# EAGLE board firefly-ice-blue (EAGLE 6.4)
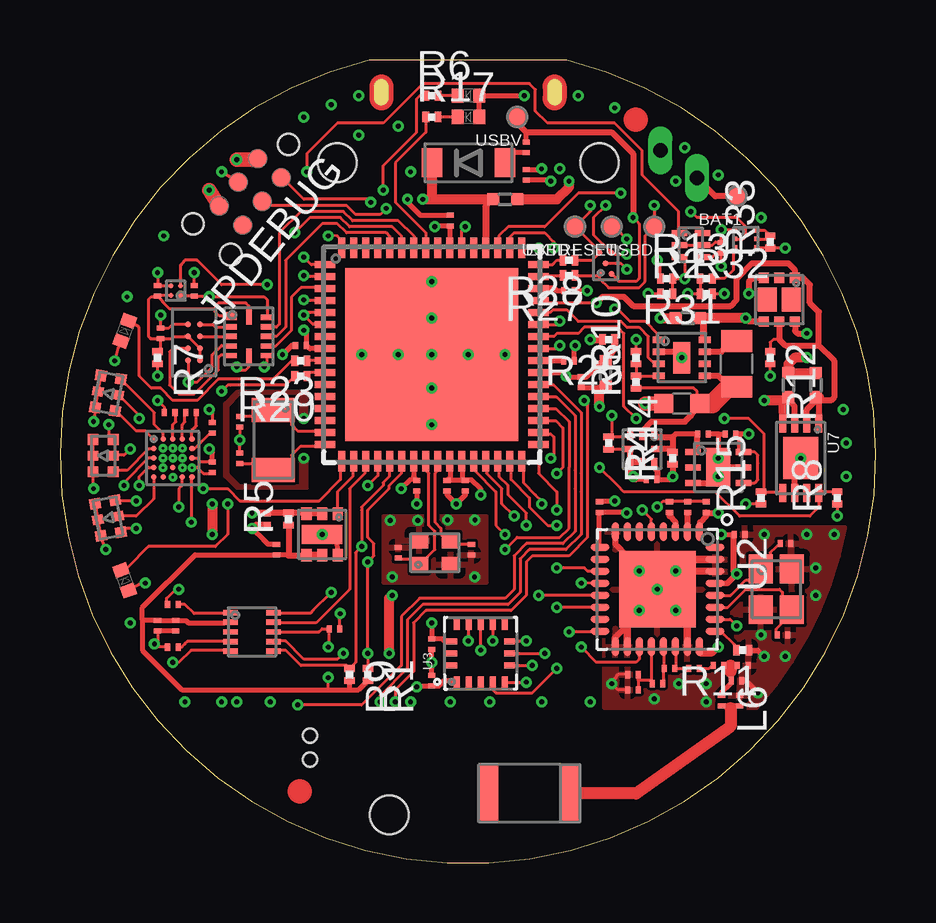
[diagram p7: board, top side]
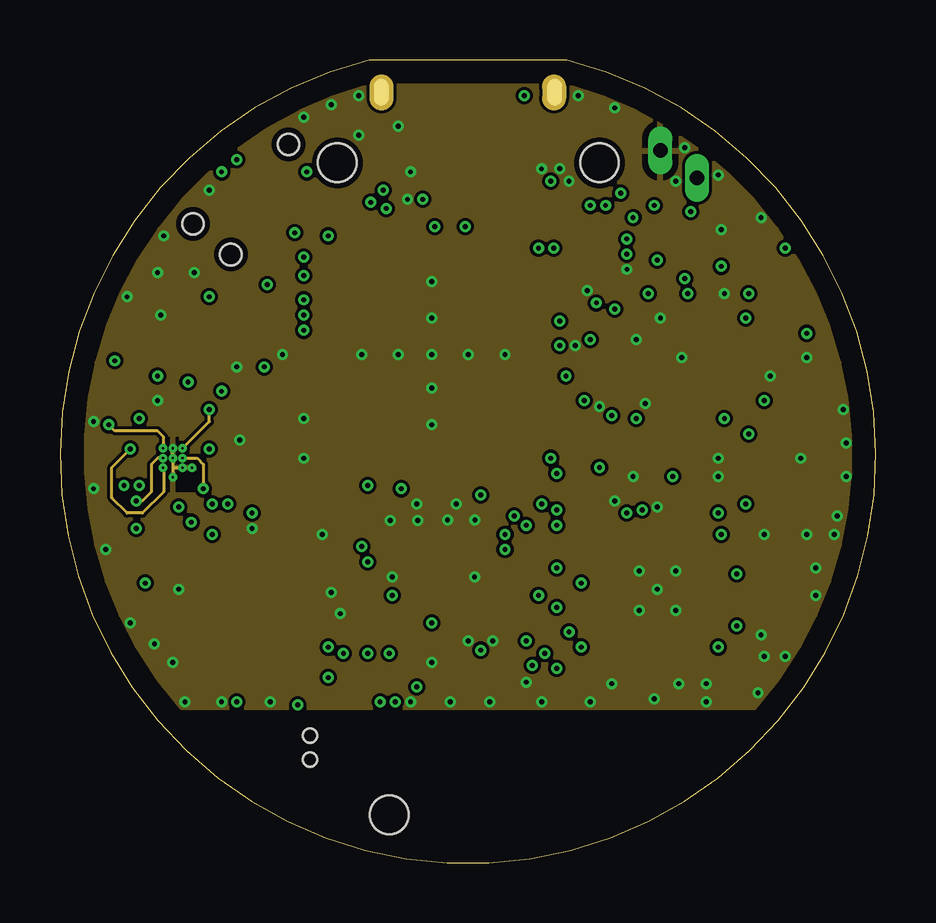
[diagram p8: board, inner layer Route2]
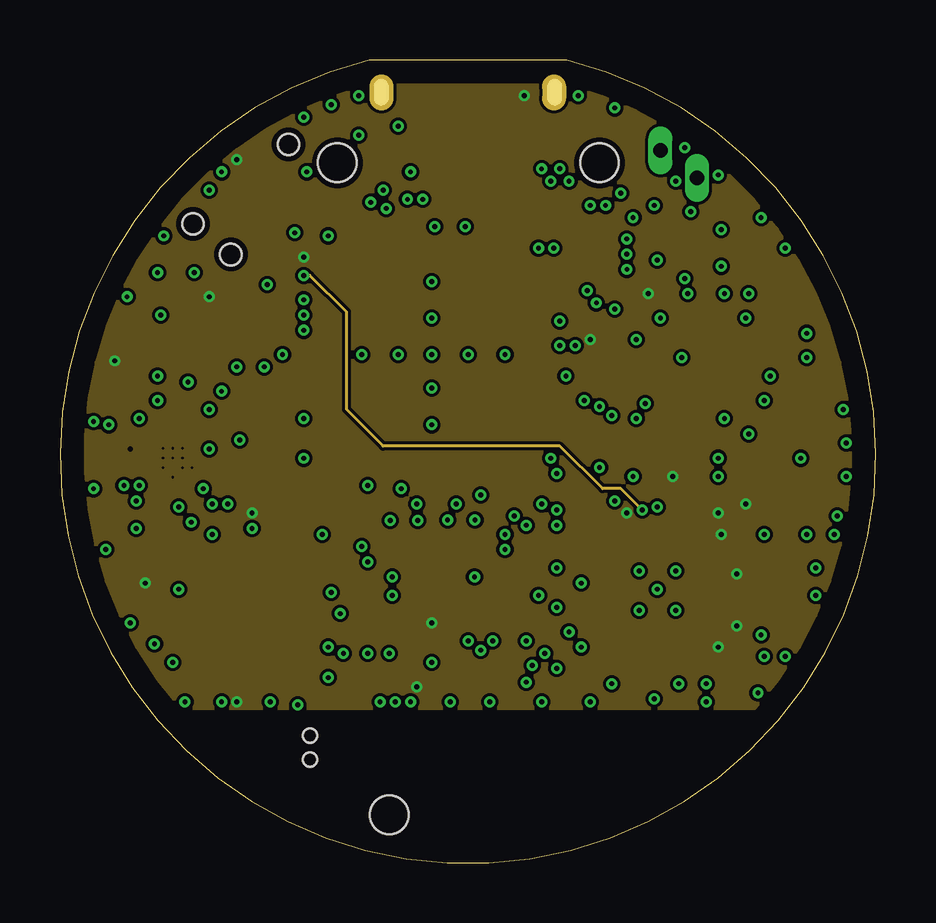
[diagram p9: board, inner layer Route15]
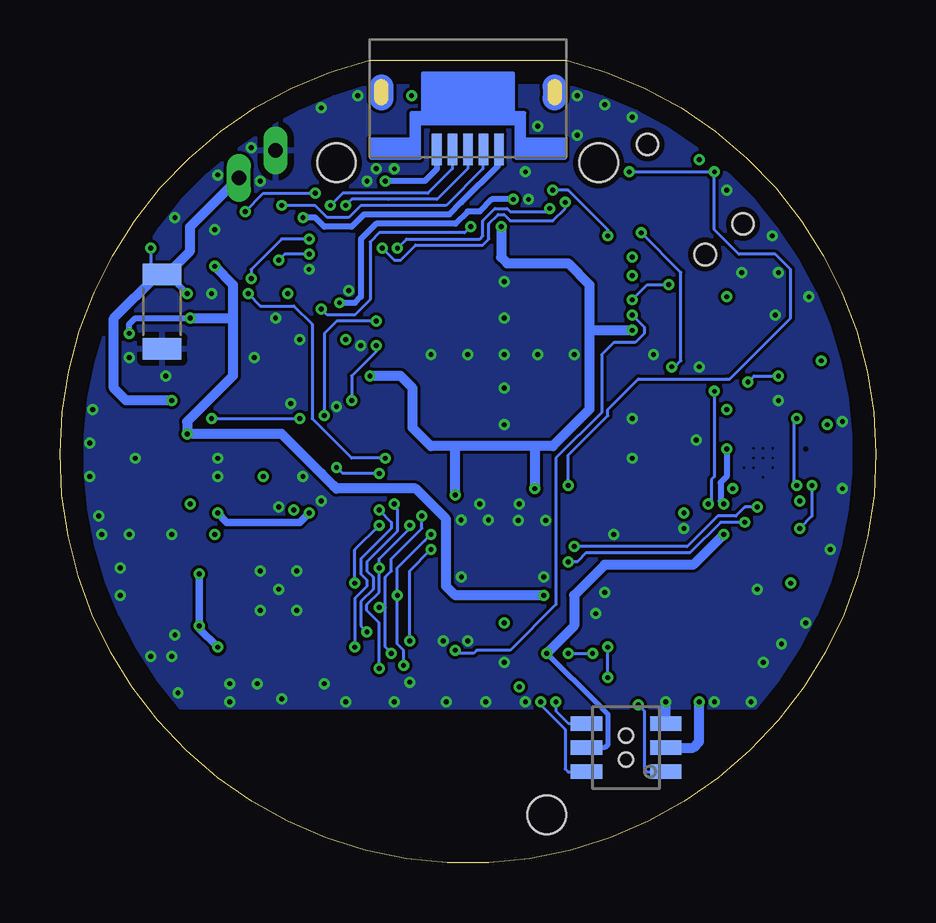
[diagram p10: board, bottom side, seen from below]

Size 34 x 33.47 mm. Coordinates in mm from the lower left corner, seen from the top.
Outline: 12.89,33.47 arc332 21.11,33.47 12.89,33.47
Copper layers [2:(1+2*15+16)]: Top 0.0178mm / dielectric 6mil / Route2 0.0356mm / dielectric 14mil / Route15 0.0356mm / dielectric 6mil / Bottom 0.0178mm
Design rules "SSC-EAGLE-4Lyr_v1.0.0.3 *": minimum track width 5mil, minimum drill 0.2mm, track to track 5mil, track to pad 5mil, pad to pad 5mil, via to via 5mil, smd to smd 5mil, copper to edge 10mil, drill to drill 16mil, minimum pad ring 8mil, minimum via ring 5mil, stop-mask expansion 3mil, vias tented up to drill 8mil, thermal gap 10mil
Holes 1.6 mm at 22.48,29.19 11.56,29.19 13.72,2.01

## Footprints (pad centres in the part's own frame; a part is rotated, then mirrored left to right if it is on the bottom)
FR05_S1_N_0_110 = smd 0.8 x 2.4: FP -1.7,0; MP 1.7,0
WP-28AWG = drill 0.6 long: 1 0,0
TARGET-PIN-1MM = smd 0.84 x 0.84: 1 0,0
C0201 = smd 0.21 x 0.3: 1 -0.22,0; 2 0.22,0
C0402 = smd 0.5 x 0.5: 1 -0.5,0; 2 0.5,0
C0603 = smd 0.8 x 0.8: 1 -0.75,0; 2 0.75,0
C1206 = smd 0.9 x 1.6: 1 -1.55,0; 2 1.55,0
D0402 = smd 0.5 x 0.6: A 0.45,0; C -0.45,0
SMLP36 = smd 0.45 x 0.45: 1 -0.675,-0.425; 2 -0.675,0.425; 5 0.675,-0.425; 6 0.675,0.425 | smd 0.4 x 0.45: 3 0,-0.425; 4 0,0.425
SOD-123F = smd 0.85 x 1.2: A 1.525,0; C -1.525,0
ZX62WD1-B-5PC = smd 0.4 x 1.3: 1 -1.3,3.73; 2 -0.65,3.73; 3 0,3.73; 4 0.65,3.73; 5 1.3,3.73
M40-3100345R = smd 1.3 x 0.6: 1 -1.65,1; 2 -1.65,0; 3 -1.65,-1; 4 1.65,-1; 5 1.65,0; 6 1.65,1 | hole 0.6: 0,-0.5; 0,0.5
TC2030-MCP-NL = smd 0.787 x 0.787: 1 1.27,-0.635; 2 1.27,0.635; 3 2.54,-0.635; 4 2.54,0.635 | smd 0.72 x 0.72: 5 3.81,-0.635; 6 3.81,0.635 | hole 0.889: 0,0; 5.08,-1.016; 5.08,1.016
L0201 = smd 0.21 x 0.3: 1 -0.22,0; 2 0.22,0
L0805 = smd 0.9 x 1.3: 1 -0.95,0; 2 0.95,0
R0201 = smd 0.28 x 0.43: 1 -0.255,0; 2 0.255,0
QFN64 = smd 0.85 x 0.3: 1 -4.45,3.75; 2 -4.45,3.25; 3 -4.45,2.75; 4 -4.45,2.25; 5 -4.45,1.75; 6 -4.45,1.25; 7 -4.45,0.75; 8 -4.45,0.25; 9 -4.45,-0.25; 10 -4.45,-0.75; 11 -4.45,-1.25; 12 -4.45,-1.75; 13 -4.45,-2.25; 14 -4.45,-2.75; 15 -4.45,-3.25; 16 -4.45,-3.75; 33 4.45,-3.75; 34 4.45,-3.25; 35 4.45,-2.75; 36 4.45,-2.25; 37 4.45,-1.75; 38 4.45,-1.25; 39 4.45,-0.75; 40 4.45,-0.25; 41 4.45,0.25; 42 4.45,0.75; 43 4.45,1.25; 44 4.45,1.75; 45 4.45,2.25; 46 4.45,2.75; 47 4.45,3.25; 48 4.45,3.75 | smd 0.3 x 0.85: 17 -3.75,-4.45; 18 -3.25,-4.45; 19 -2.75,-4.45; 20 -2.25,-4.45; 21 -1.75,-4.45; 22 -1.25,-4.45; 23 -0.75,-4.45; 24 -0.25,-4.45; 25 0.25,-4.45; 26 0.75,-4.45; 27 1.25,-4.45; 28 1.75,-4.45; 29 2.25,-4.45; 30 2.75,-4.45; 31 3.25,-4.45; 32 3.75,-4.45; 49 3.75,4.45; 50 3.25,4.45; 51 2.75,4.45; 52 2.25,4.45; 53 1.75,4.45; 54 1.25,4.45; 55 0.75,4.45; 56 0.25,4.45; 57 -0.25,4.45; 58 -0.75,4.45; 59 -1.25,4.45; 60 -1.75,4.45; 61 -2.25,4.45; 62 -2.75,4.45; 63 -3.25,4.45; 64 -3.75,4.45 | smd 7.2 x 7.2: 65 0,0
QFN-32 = smd 0.8 x 0.3: 1 -2.4,1.75; 2 -2.4,1.25; 3 -2.4,0.75; 4 -2.4,0.25; 5 -2.4,-0.25; 6 -2.4,-0.75; 7 -2.4,-1.25; 8 -2.4,-1.75; 17 2.4,-1.75; 18 2.4,-1.25; 19 2.4,-0.75; 20 2.4,-0.25; 21 2.4,0.25; 22 2.4,0.75; 23 2.4,1.25; 24 2.4,1.75 | smd 0.3 x 0.8: 9 -1.75,-2.4; 10 -1.25,-2.4; 11 -0.75,-2.4; 12 -0.25,-2.4; 13 0.25,-2.4; 14 0.75,-2.4; 15 1.25,-2.4; 16 1.75,-2.4; 25 1.75,2.4; 26 1.25,2.4; 27 0.75,2.4; 28 0.25,2.4; 29 -0.25,2.4; 30 -0.75,2.4; 31 -1.25,2.4; 32 -1.75,2.4 | smd 3.2 x 3.2: 33 0,0
LGA16_3X3 = smd 0.45 x 0.25: 1 -1.2,1; 2 -1.2,0.5; 3 -1.2,0; 4 -1.2,-0.5; 5 -1.2,-1; 9 1.2,-1; 10 1.2,-0.5; 11 1.2,0; 12 1.2,0.5; 13 1.2,1 | smd 0.25 x 0.45: 6 -0.5,-1.2; 7 0,-1.2; 8 0.5,-1.2; 14 0.5,1.2; 15 0,1.2; 16 -0.5,1.2
DFN10-2X2 = smd 0.6 x 0.225: 1 -0.9,0.8; 2 -0.9,0.4; 3 -0.9,0; 4 -0.9,-0.4; 5 -0.9,-0.8; 6 0.9,-0.8; 7 0.9,-0.4; 8 0.9,0; 9 0.9,0.4; 10 0.9,0.8
WL-CSP-25 = smd 0.225 x 0.225: A1 -0.8,0.8; A2 -0.4,0.8; A3 0,0.8; A4 0.4,0.8; A5 0.8,0.8; B1 -0.8,0.4; B2 -0.4,0.4; B3 0,0.4; B4 0.4,0.4; B5 0.8,0.4; C1 -0.8,0; C2 -0.4,0; C3 0,0; C4 0.4,0; C5 0.8,0; D1 -0.8,-0.4; D2 -0.4,-0.4; D3 0,-0.4; D4 0.4,-0.4; D5 0.8,-0.4; E1 -0.8,-0.8; E2 -0.4,-0.8; E3 0,-0.8; E4 0.4,-0.8; E5 0.8,-0.8
SOT963 = smd 0.2 x 0.2: 1 -0.45,0.36; 2 -0.45,0; 3 -0.45,-0.36; 4 0.45,-0.36; 5 0.45,0; 6 0.45,0.36
DFN8 = smd 0.75 x 0.3: 1 -1.45,0.75; 2 -1.45,0.25; 3 -1.45,-0.25; 4 -1.45,-0.75; 5 1.45,-0.75; 6 1.45,-0.25; 7 1.45,0.25; 8 1.45,0.75 | smd 1.75 x 1.45: PGND 0,0
WLCSP5 = smd 0.26 x 0.26: A1 -0.435,0.25; A2 -0.435,-0.25; B1 0,0; C1 0.435,0.25; C2 0.435,-0.25
MICROFET-2X2-6L = smd 0.52 x 0.42: 1 -0.865,0.65; 2 -0.865,0; 3 -0.865,-0.65; 4 0.865,-0.65; 5 0.865,0; 6 0.865,0.65 | smd 0.8 x 1.68: 7 0,0
UDFN6 = smd 0.65 x 0.25: 1 -0.475,0.5; 2 -0.475,0; 3 -0.475,-0.5; 4 0.475,-0.5; 5 0.475,0; 6 0.475,0.5
S-PWSON-N6 = smd 0.65 x 0.25: 1 -1.05,0.65; 2 -1.05,0; 3 -1.05,-0.65; 4 1.05,-0.65; 5 1.05,0; 6 1.05,0.65 | smd 1 x 1.6: TP 0,0
S-PWSON-N8 = smd 0.5 x 0.28: 1 -0.95,0.75; 2 -0.95,0.25; 3 -0.95,-0.25; 4 -0.95,-0.75; 5 0.95,-0.75; 6 0.95,-0.25; 7 0.95,0.25; 8 0.95,0.75 | smd 0.7 x 1.3: TP 0,0
SOT902-2 = smd 0.35 x 0.25: 1 -0.55,0.5; 2 -0.55,0; 3 -0.55,-0.5; 5 0.55,-0.5; 6 0.55,0; 7 0.55,0.5 | smd 0.25 x 0.35: 4 0,-0.55; 8 0,0.55
MO-229 = smd 0.42 x 0.42: 1 -0.915,0.65; 2 -0.915,0; 3 -0.915,-0.65; 4 0.915,-0.65; 5 0.915,0; 6 0.915,0.65 | smd 1 x 0.8: C 0,0.5; D 0,-0.5
WLBGA-8 = smd 0.25 x 0.25: A1 -0.25,0.75; A2 0.25,0.75; B1 -0.25,0.25; B2 0.25,0.25; C1 -0.25,-0.25; C2 0.25,-0.25; D1 -0.25,-0.75; D2 0.25,-0.75
CB-4-3 = smd 0.21 x 0.21: A1 -0.2,0.2; A2 0.2,0.2; B1 -0.2,-0.2; B2 0.2,-0.2
XQFN12 = smd 0.5 x 0.32: 1 -0.75,0.85 | smd 0.5 x 0.22: 2 -0.75,0.4; 3 -0.75,0; 4 -0.75,-0.4; 5 -0.75,-0.8; 7 0.75,-0.8; 8 0.75,-0.4; 9 0.75,0; 10 0.75,0.4; 11 0.75,0.8 | smd 0.22 x 0.65: 6 0,-0.825; 12 0,0.825
9HT10 = smd 1 x 1.8: 1 -1.25,0; 2 1.25,0
XTAL2520 = smd 1 x 1.2: 1 -0.65,0.85; 2 -0.65,-0.85; 3 0.65,-0.85; 4 0.65,0.85
ABM11 = smd 0.65 x 0.75: 1 -0.5,0.65; 2 -0.5,-0.65; 3 0.5,-0.65; 4 0.5,0.65

## Placement (x,y rotation side)
A1  FR05_S1_N_0_110  [FR05_S1_N_0_110]  19.56,2.9 180 top
B+  TARGET-PINWP-28AWG  [WP-28AWG]  26.54,28.55 0 top
B-  TARGET-PINWP-28AWG  [WP-28AWG]  25.02,29.7 0 top
BAT1  TARGET-PIN  [TARGET-PIN-1MM]  28.19,27.79 180 top
C1  100nF  [C0201]  15.49,9.12 270 top
C2  100nF  [C0201]  9.02,13.06 90 top
C3  1uF  [C0201]  24.64,15.98 180 top
C4  4.7uF  [C0402]  30.35,19.92 90 top
C5  4.7uF  [C0402]  31.5,19.92 90 top
C6  1.2pF  [C0201]  28.19,7.6 0 top
C7  DNS  [C0201]  28.32,6.77 90 top
C8  1uF  [C0201]  21.21,23.85 0 top
C9  100nF  [C0201]  27.56,25.63 90 top
C10  1uF  [C0201]  8.64,14.33 270 top
C11  1uF  [C0201]  5.59,23.85 90 top
C12  100nF  [C0201]  11.43,9.76 0 top
C13  100nF  [C0201]  4.06,9.88 270 top
C14  1uF  [C0201]  4.83,9.88 270 top
C15  4.7uF  [C0402]  18.54,27.66 0 top
C16  100nF  [C0201]  4.7,10.77 180 top
C17  100nF  [C0201]  4.7,9 180 top
C18  10uF  [C0402]  26.16,22.71 180 top
C19  22uF  [C0603]  25.91,19.16 180 top
C20  1uF  [C0201]  27.94,17.89 180 top
C21  1uF  [C0201]  26.8,17.89 0 top
C22  18pF  [C0201]  14.1,12.93 90 top
C23  100nF  [C0201]  15.49,7.6 90 top
C24  1uF  [C0201]  21.21,20.93 0 top
C25  10uF  [C0402]  22.73,20.43 270 top
C26  100nF  [C0201]  21.72,20.04 270 top
C27  100nF  [C0201]  16.13,15.73 270 top
C28  100nF  [C0201]  16.26,26.78 90 top
C29  100nF  [C0201]  10.03,21.57 180 top
C30  100nF  [C0201]  16.89,15.73 270 top
C31  100nF  [C0201]  14.86,15.73 270 top
C32  22pF  [C0201]  7.49,16.87 90 top
C33  22pF  [C0201]  7.49,18.39 270 top
C34  15pF  [C0201]  30.1,9.5 0 top
C35  15pF  [C0201]  30.23,13.31 0 top
C36  1uF  [C0201]  4.06,23.85 90 top
C39  1nF  [C0201]  28.32,13.69 0 top
C40  33nF  [C0201]  25.4,14.84 90 top
C41  100nF  [C0201]  26.16,14.84 90 top
C42  1uF  [C0201]  26.92,14.84 90 top
C43  100nF  [C0201]  22.48,14.84 90 top
C44  2.2nF  [C0201]  23.88,7.85 180 top
C45  DNS  [C0201]  23.88,7.22 180 top
C46  1.2pF  [C0201]  28.45,8.23 0 top
C47  1.8pF  [C0201]  27.43,8.23 0 top
C48  18pF  [C0201]  17.14,13.06 270 top
C50  1uF  [C0201]  6.35,16.49 270 top
C51  100uF  [C1206]  29.75,22.98 270 bottom
C52  1uF  [C0201]  4.57,18.77 180 top
C53  470nF  [C0201]  6.35,18.14 90 top
C54  470nF  [C0201]  5.46,18.77 180 top
C55  100nF  [C0201]  4.19,22.08 90 top
D0  LEDD0402  [D0402]  2.7,11.78 290 top
D1  LED-RGB  [SMLP36]  2,14.38 280 top
D2  LED-RGB  [SMLP36]  1.8,16.98 270 top
D3  LED-RGB  [SMLP36]  2,19.58 260 top
D4  LEDD0402  [D0402]  2.7,22.18 250 top
D5  LEDD0402  [D0402]  17.02,31.09 0 top
D6  LEDD0402  [D0402]  17.02,31.98 0 top
D10  BAT54WSSOD-123F  [SOD-123F]  17.02,29.19 0 top
EXTRESET  TARGET-PIN  [TARGET-PIN-1MM]  22.99,26.52 180 top
J1  USB-5PINZX62WD1-B-5PC  [ZX62WD1-B-5PC]  17,33.47 180 bottom
J2  CON-6SOCKET  [M40-3100345R]  10.41,4.8 180 bottom
JPDEBUG  TC2030-SWD  [TC2030-MCP-NL]  9.52,29.95 231 top
L1  8.2nH  [L0201]  25.4,8.11 0 top
L2  5.6nH  [L0201]  24.89,7.47 0 top
L3  3.9nH  [L0201]  26.42,8.11 0 top
L4  Ferrite Bead  [L0201]  19.43,28.68 270 top
L6  7.5nH  [L0201]  27.56,6.77 270 top
L7  1uH  [L0805]  28.19,20.81 270 top
L9  Ferrite Bead  [L0201]  19.43,29.82 270 top
R1  4.7k  [R0201]  12.83,7.85 270 top
R2  100k  [R0201]  25.27,23.73 0 top
R3  182k  [R0201]  24,20.04 90 top
R4  1M  [R0201]  22.86,17.5 270 top
R5  0 (OPT)  [R0201]  9.52,14.33 90 top
R6  25  [R0201]  15.49,31.98 0 top
R7  100k  [R0201]  4.06,21.06 270 top
R8  12.4k  [R0201]  32.38,15.22 90 top
R9  4.7k  [R0201]  12.06,7.85 270 top
R10  39.2k  [R0201]  24,21.06 90 top
R11  22k  [R0201]  28.45,8.87 180 top
R12  100k  [R0201]  29.59,21.06 270 top
R13  0 (OPT)  [R0201]  25.27,24.36 0 top
R14  0 (OPT)  [R0201]  25.53,16.87 90 top
R15  100k  [R0201]  29.21,15.22 90 top
R17  50  [R0201]  15.49,31.09 0 top
R20  50  [R0201]  10.03,20.3 180 top
R23  50  [R0201]  10.03,20.93 180 top
R25  0  [R0201]  22.86,21.82 180 top
R27  15  [R0201]  21.21,24.49 180 top
R28  15  [R0201]  21.21,25.12 180 top
R31  100k  [R0201]  26.92,24.36 180 top
R32  100k  [R0201]  26.92,23.73 0 top
R33  100k  [R0201]  29.59,25.89 90 top
U1  EFM32LG330F256  [QFN64]  15.49,21.19 0 top
U2  NRF8001  [QFN-32]  24.89,11.41 270 top
U3  LIS3DH  [LGA16_3X3]  17.53,8.74 90 top
U4  MAG3110  [DFN10-2X2]  8,9.63 0 top
U5  AS3661WL-CSP-25  [WL-CSP-25]  4.7,16.88 0 top
U6  MOSFET-N+PSOT963  [SOT963]  28.57,26.01 0 top
U7  MCP73832DFN8  [DFN8]  30.86,16.87 270 top
U8  USB-ESD3WLCSP5  [WLCSP5]  22.73,25 90 top
U9  FPF100X  [MICROFET-2X2-6L]  10.92,13.69 270 top
U10  STM6519  [UDFN6]  26.29,25.76 0 top
U11  TPS782XX  [S-PWSON-N6]  27.43,16.49 0 top
U12  TPS6208X  [S-PWSON-N8]  25.91,21.06 0 top
U13  NX3L1T53  [SOT902-2]  24.26,17.25 270 top
U14  FDFMA2P029Z  [MO-229]  29.97,23.47 270 top
U16  MEMORY-SPIWLBGA-8  [WLBGA-8]  5.59,21.7 180 top
U17  ADP151  [CB-4-3]  4.83,23.85 180 top
U18  NTB0104  [XQFN12]  7.87,21.95 0 top
USBD+  TARGET-PIN  [TARGET-PIN-1MM]  21.46,26.52 180 top
USBD-  TARGET-PIN  [TARGET-PIN-1MM]  24.76,26.52 180 top
USBV  TARGET-PIN  [TARGET-PIN-1MM]  19.05,31.09 180 top
X1  32kHz  [9HT10]  8.89,17.63 270 top
X2  16MHz  [XTAL2520]  29.84,11.41 0 top
X4  48MHz  [ABM11]  15.62,12.93 90 top

## Tracks (layer width: path | path; a pad name or v marks a point on that pad's centre or on a via)
ACC_CSN  (via drill 0.2)
  Top 0.127: U3.8 18.8,9.25 v19.43,9.25 | U1.36 20.66,18.94 21.21,18.39 21.21,16.49 21.21,15.73 21.21,13.95 20.83,13.57 19.05,13.57 v18.54,13.06
  Bottom 0.127: v19.43,9.25 19.43,12.17 v18.54,13.06
ACC_INT  (via drill 0.2)
  Top 0.127: v17.53,8.87 U3.11 | U1.6 11.04,22.46 10.79,22.46 10.54,22.46 v10.16,22.84 10.29,22.94 U1.5
  Bottom 0.127: v10.16,22.84 9.65,22.33 9.65,22.08 10.03,21.7 10.92,21.7 11.43,21.19 11.43,18.77 13.33,16.87 13.33,10.77 15.24,8.87 16.64,8.87 16.76,8.74 17.4,8.74 v17.53,8.87
BAT_V  (via drill 0.2)
  Top 0.127: BAT1.1 | C4.1 30.1,19.27 30.1,19.28 | U6.4 29.7,25.65 R33.1 29.72,25.63 v30.23,25.63
  Top 0.254: U7.3 30.61,19.03 C4.1 | BAT1.1 27.3,27.79 B+.1 | U14.3 28.98,24.39 28.85,24.39 28.7,24.24 v28.7,23.73
  Top 0.305: U7.4 30.1,19.16 C4.1
  Top 0.406: 30.1,19.28 v29.34,19.28
  Bottom 0.127: C51.1 29.97,24.49 C51.1 | v30.23,25.63 30.23,24.86 C51.1
  Bottom 0.254: v28.7,23.73 29.08,24.11 29.34,24.36 29.58,24.36 C51.1
  Bottom 0.406: B+.1 28.57,26.52 28.57,25.51 29.34,24.74 29.59,24.49 29.97,24.49 31.75,22.71 31.75,19.79 31.24,19.28 v29.34,19.28
BAT_V/2  (via drill 0.2)
  Top 0.127: U1.34 20.14,17.94 20.32,17.89 20.45,17.89 20.57,17.76 20.57,17.12 20.57,17 v20.45,16.87 | v26.16,23.73 R32.1 R31.2
  Bottom 0.127: v26.16,23.73 25.65,23.22 24.26,23.22 23.49,22.46 23.49,18.52 21.84,16.87 v20.45,16.87
BAT_V/2EN  (via drill 0.2)
  Top 0.127: v26.29,27.16 26.54,26.9 28.19,26.9 28.57,26.52 28.57,26.14 28.45,26.01 U6.2 | v23.37,27.92 21.59,27.92 20.19,26.52 18.67,26.52 18.29,26.14 18.29,25.68 U1.51
  Bottom 0.127: v26.29,27.16 25.53,27.92 v23.37,27.92
CHG_RATE  (via drill 0.2)
  Top 0.127: R8.2 32.26,15.47 31.62,15.47 31.62,15.42 U7.8 31.61,15.36 31.62,15.22 31.62,14.84 31.24,14.46 28.32,14.46 27.3,15.47 23.49,15.47 23.24,15.73 v22.48,16.49 | U1.35 20.66,18.44 20.95,18.14 20.95,16.49 v20.7,16.23
  Bottom 0.127: v20.7,16.23 22.22,16.23 v22.48,16.49
CHG_STAT  (via drill 0.2)
  Top 0.127: 29.34,15.47 29.34,17.89 28.7,18.52 v27.69,18.52 | v24,18.52 23.49,19.03 23.49,22.08 23.24,22.33 21.84,22.33 21.59,22.08 20.7,22.08 20.57,21.95 20.45,21.95 20.08,21.95 U1.42 | 29.34,15.47 30.11,15.47 U7.5 | 29.34,15.47 R15.2
  Bottom 0.127: v27.69,18.52 v24,18.52
CLK32K  (via drill 0.2)
  Top 0.127: U2.5 24.64,14.33 v24.26,14.71 | U1.2 10.29,24.44 v10.16,24.49
  Route15 0.127: v24.26,14.71 23.37,15.6 22.61,15.6 20.83,17.38 13.46,17.38 11.94,18.9 11.94,22.97 10.41,24.49 v10.16,24.49
GND  (via drill 0.1 layers 1-2, 0.2, 0.2 pad 0.2)
  Top 0.127: R11.1 | 26.16,10.14 v25.65,10.52 U2.33 | 23.62,10.14 v24.13,10.52 U2.33 | 26.16,12.68 v25.65,12.17 U2.33 | C45.2 23.24,7.22 v22.99,7.47 23.24,7.85 C44.2 | 11.56,13.57 11.43,13.69 U9.7 | U3.12 17.02,9.87 17.02,9.82 v17.02,9.25 | U3.10 18.03,9.87 18.03,9.82 v18.03,9.25 | U3.5 18.54,7.53 v19.43,7.53 | C16.2 4.44,10.77 4.44,11.03 4.83,11.41 v4.95,11.41 | U4.5 6.9,8.83 6.86,8.87 5.46,8.87 4.95,8.36 v4.7,8.36 | C17.2 4.06,9 v3.94,9.12 4.06,9.25 C13.2 | U4.10 8.98,10.43 10.45,10.43 10.54,10.52 v11.3,11.28 | C12.2 11.65,10.36 v11.68,10.39 | 31.5,20.55 C5.2 | 30.61,16.62 U7.PGND | U11.TP v27.43,16.11 27.18,15.85 | 25.78,21.31 U12.TP 25.91,20.68 | 23.75,17.12 23.75,17.21 U13.4 R4.2 | 23.75,16.74 U13.5 | 30.61,15.35 U7.6 | R8.1 32.38,14.71 v32.38,14.46 | R10.2 v24,21.82 | C42.2 C41.2 C40.2 25.11,15.06 v24.89,14.84 | U8.B1 23.37,25 v23.62,24.74 | U16.D2 4.7,22.46 4.57,22.33 4.54,22.3 C55.2 v4.19,22.84 | U17.B2 4.12,24.05 C36.2 v4.06,24.62 | C11.2 v5.59,24.62 | U10.5 27.18,25.76 27.3,25.89 27.56,25.89 | 27.56,25.89 C9.2 | U10.2 U10.5 | 27.56,25.89 v27.56,26.39 27.71,26.37 U6.1 | U10.6 U10.5 | D3.3 D3.1 D3.3 | D3.3 D3.5 | D2.1 D2.3 D2.5 1.37,15.62 v1.4,15.6 | D3.3 D3.5 | D3.5 v1.4,18.39 | v1.9,13.06 D1.5 D1.3 D1.1 | v4.06,19.28 4.35,18.99 C52.2 | U5.D5 5.58,16.48 5.59,16.49 5.71,16.49 5.97,16.23 6.22,16.23 C50.2 | R32.2 v27.69,23.73 | v7.37,20.68 7.49,20.55 7.75,20.55 7.87,20.68 U18.6 | C33.2 v7.49,17.63 C32.2 | v29.59,20.3 R12.2
  Top 0.152: v25.65,12.17 U2.33
  Top 0.2: C1.2 v15.49,8.36 C23.2 | v23.11,15.09 23.08,15.06 C43.2 | C24.2 21.43,21.53 v21.46,21.57 | U9.6 11.56,13.57 | C14.2 C13.2 | C26.2 22.44,19.82 22.48,19.79 C25.2 | C3.2 24,15.98 v23.88,16.11 | C8.2 21.72,23.85 v21.97,23.85 | C31.2 v14.86,14.96 | C30.2 16.89,15.35 v16.51,14.96 16.13,15.35 C27.2 | C29.2 9.65,21.57 v9.27,21.19 | v14.48,27.66 14.48,27.54 14.99,27.03 15.02,27 C28.2 | L4.1 19.97,28.9 v20.07,28.93 | v20.07,28.93 v20.07,28.94 v20.07,28.93 | C6.2 28.57,7.6 v29.08,7.09 | R11.1 29.08,8.87 v29.34,8.61
  Top 0.21: C10.2 8.16,14.11 v8,13.95 8.51,13.44 8.67,13.28 C2.2 | 27.43,17.89 C20.2 | 27.43,17.89 C21.2 | 27.43,17.89 v27.43,16.87
  Top 0.254: U2.17 23.11,9.38 23.37,9.63 23.49,9.76 23.49,9.88 U2.33 23.62,12.81 23.37,13.06 23.24,13.19 23.14,13.29 U2.8 | U7.6 30.61,16.62 | U11.5 U11.TP | U11.3 27.04,15.84 27.05,15.85 27.18,15.85 | v23.88,16.11 23.75,16.23 U13.5 U13.6 | U12.2 25.78,21.31 | 23.75,17.12 23.75,16.74
  Top 0.305: U2.23 26.14,9.99 26.16,10.01 26.16,10.14 | U2.18 23.64,9.99 23.62,10.01 23.62,10.14 | U2.30 v25.65,12.17 | U2.31 26.31,12.66 26.29,12.68 26.16,12.68
  Top 0.406: v22.48,19.03 22.48,19.66 C25.2 | v25.02,22.71 C18.2 | C5.2 C4.2 30.35,20.81 30.61,21.06 v31.11,21.06 | C15.2 20.7,27.66 21.21,28.17 v21.21,28.43
  Top 0.61: JPDEBUG.5 v6.22,28.05 | C19.2 v24.38,19.16
  Route2 0.127: U5.B3 U5.C3 4.7,16.48 | 4.7,16.48 U5.E3 | 4.7,16.48 U5.D4
  Bottom 0.127: v8.76,6.71
  Bottom 0.406: J2.3 v8.76,6.71
  other vias: 10.92,13.69 29.21,9.5 10.16,18.52 10.16,16.87 24.76,6.84 25.78,7.47 26.92,7.47 31.11,13.69 31.5,12.3 31.5,11.15 29.34,13.69 24.89,11.41 24.13,12.17 30.86,16.87 25.91,21.06 16.15,14.3 15.49,21.19 15.49,22.71 15.49,24.24 15.49,19.79 15.49,18.27 17.02,21.19 12.57,21.19 14.1,21.19 18.54,21.19 13.84,11.92 17.27,11.92 29.21,26.9 4.7,16.08 5.1,16.48 4.7,16.88 4.7,17.28 5.5,16.48 14.91,14.27 13.76,14.27 17.29,14.3 5.21,6.71 6.73,6.71 2.92,10.01 26.92,6.71 30.23,8.61 32.26,13.69 22.1,6.71 14.6,6.71 27.43,28.68 26.03,29.82 21.59,31.98 23.11,31.47 20.83,28.93 12.45,31.98 14.6,28.81 10.16,31.09 11.3,31.6 4.32,26.14 2.79,23.6 17.91,6.71 20.07,6.71 16.26,6.71 32.64,18.9 32.77,16.11 32.77,17.5 14.1,30.71 12.45,30.33 25.65,28.43
  pour Top: 6.86,16.11 6.86,19.16 7.37,19.66 10.29,19.66 10.29,18.39 10.03,18.39 10.03,19.54 7.49,19.54 6.98,19.03 6.98,16.23 7.49,15.73 10.03,15.73 10.03,17 10.29,17 10.29,15.6 7.37,15.6
  pour Top: 22.68,6.48 29.02,6.48 arc31 32.7,13.97 22.68,13.97
  pour Top: 13.46,14.46 13.46,11.66 17.78,11.66 17.78,14.46
  pour Bottom: 12.89,32.37 arc117 5.06,6.48 28.94,6.48 arc117 21.11,32.37
  pour Route2: 12.89,32.37 arc117 5.06,6.48 28.94,6.48 arc117 21.11,32.37
I2C0_INT  (via drill 0.2)
  Top 0.127: U1.41 20.7,21.44 v20.83,21.57 | v21.84,19.28 21.97,19.16 21.97,16.11 21.97,15.35 21.97,13.57 21.21,12.81 19.68,12.81 19.43,12.55 19.43,11.15 18.8,10.52 15.24,10.52 14.73,10.01 14.73,7.98 13.97,7.22 v13.97,6.71
  Bottom 0.127: v20.83,21.57 20.83,21.31 21.84,20.3 v21.84,19.28 | v13.97,6.71 13.97,6.58 12.95,5.57 12.95,3.92 12.83,3.79 12.08,3.79 J2.6
I2C0_SCL  (via drill 0.2)
  Top 0.127: U1.38 20.55,19.94 21.72,18.77 21.72,16.23 21.72,15.47 21.72,13.69 21.08,13.06 19.56,13.06 19.18,12.68 19.18,11.28 18.67,10.77 15.11,10.77 14.48,10.14 14.48,8.11 13.33,6.96 v13.33,6.71
  Bottom 0.127: v13.33,6.71 13.33,6.33 12.83,5.82 12.08,5.82 J2.4
I2C0_SDA  (via drill 0.2)
  Top 0.127: U1.37 20.67,19.44 21.46,18.65 21.46,16.36 21.46,15.6 21.46,13.82 20.95,13.31 19.43,13.31 18.92,12.81 18.92,11.41 18.54,11.03 14.99,11.03 14.22,10.27 14.22,8.23 12.57,6.58 v9.91,6.58
  Bottom 0.127: v9.91,6.58 9.65,6.33 9.65,3.92 9.52,3.79 8.78,3.79 J2.1
I2C1_PWR
  Top 0.127: U9.1 11.56,14.71 | 11.43,14.71 U9.1 | U1.18 12.19,16.36 12.19,16.11 11.56,15.47 11.56,14.57 U9.1
I2C1_SCL  (via drill 0.2)
  Top 0.127: v11.81,8.74 11.56,8.49 10.16,8.49 9.4,9.25 9.14,9.25 9.14,9.23 U4.7 | R1.1 v12.83,8.74 12.83,8.87 v12.83,12.55 13.08,12.81 13.08,13.31 12.83,13.57 12.83,14.71 13.72,15.6 13.72,15.73 14.22,16.23 U1.22 | U5.E5 5.46,15.98 v5.46,14.2
  Bottom 0.127: v12.83,8.74 11.94,8.74 v11.81,8.74 | v12.83,12.55 12.45,12.55 12.06,12.93 7.75,12.93 6.48,14.2 v5.46,14.2
I2C1_SDA  (via drill 0.2)
  Top 0.127: U4.6 9.02,8.87 9.4,8.87 10.03,8.23 11.94,8.23 R9.1 12.32,8.36 12.32,12.93 v12.57,13.19 12.57,14.71 12.57,14.84 13.46,15.73 13.46,15.85 13.72,16.11 U1.21 | U5.E4 5.08,15.98 5.08,15.73 4.95,15.6 v4.95,14.84
  Bottom 0.127: v4.95,14.84 5.46,14.84 5.84,14.46 6.6,14.46 7.87,13.19 v12.57,13.19
I2C1_V+  (via drill 0.2)
  Top 0.127: v11.18,9 11.21,9.03 C12.1 10.92,9.76 10.79,9.63 U4.8 | 11.18,7.22 v11.18,7.73
  Top 0.2: U4.2 6.88,10.03 6.86,10.01 5.33,10.01 5.24,10.1 C14.1 C13.1 3.46,10.1 3.43,10.14 | 3.43,10.14 3.43,8.87 5.08,7.22 11.18,7.22 12.06,7.22 | 12.06,7.22 R9.2 | R1.2 12.7,7.47 12.45,7.22 12.06,7.22 | 3.43,10.14 3.43,10.65 5.59,12.81
  Top 0.21: 5.59,12.81 5.62,12.84 C2.1 9.49,12.84 9.52,12.81
  Top 0.254: U9.5 U9.4 10.16,12.81 9.52,12.81 R5.1
  Bottom 0.127: v11.18,7.73 v11.18,9
LED0
  Top 0.127: U1.10 10.3,20.44 R20.1
LED4
  Top 0.127: U1.9 R23.1
LED5
  Top 0.127: R17.1 15.24,30.46 13.97,29.19 13.97,27.54 15.24,26.27 U1.57
LED6  (via drill 0.2)
  Top 0.127: R6.1 14.99,31.98 14.86,31.86 14.86,30.46 13.46,29.06 v13.46,28.05 | U1.64 11.68,26.01 11.56,26.13 v11.18,26.14
  Bottom 0.127: v11.18,26.14 11.18,26.39 12.83,28.05 v13.46,28.05
LED_EN  (via drill 0.1 layers 1-2, 0.2)
  Top 0.127: U1.17 11.68,16.49 11.68,15.98 10.79,15.09 7.49,15.09 6.98,15.6 v5.97,15.6
  Route2 0.127: U5.C4 5.08,16.87 5.71,16.87 5.97,16.62 v5.97,15.6
  other vias: 5.1,16.88
MAG_INT
  Top 0.127: U4.9 9.12,10.03 9.14,10.01 10.67,10.01 12.06,11.41 12.06,15.6 12.7,16.23 12.7,16.49 U1.19
MEM_CSN
  Top 0.127: U1.3 10.92,23.98 10.03,23.98 9.65,23.6 9.65,22.2 9,21.55 U18.8
N$1
  Top 0.2: L6.2 27.91,6.55 27.94,6.58 27.94,6.46
  Top 0.21: C7.1 L6.2
  Top 0.5: A1.FP 24,2.9 27.94,5.69 27.94,6.46
N$2  (via drill 0.1 layers 1-2, 0.2)
  Top 0.127: v3.17,15.09 2.33,15.09 D1.2
  Route2 0.127: U5.C2 4.06,16.87 3.81,16.62 3.81,15.47 3.43,15.09 v3.17,15.09
  other vias: 4.3,16.88
N$3  (via drill 0.2)
  Top 0.2: v20.45,28.43 20.41,28.46 L4.2
  Bottom 0.254: J1.5 18.3,28.92 18.8,28.43 v20.45,28.43
N$4
  Top 0.127: R10.1 R3.2 24.89,20.3 U12.4
N$5
  Top 0.127: U5.A3 4.7,18.27 4.83,18.39 4.83,18.65 C52.1
N$6  (via drill 0.1 layers 1-2, 0.2)
  Top 0.127: v6.22,18.9 6.35,18.77 C53.2
  Route2 0.127: U5.B4 6.22,18.39 v6.22,18.9
  other vias: 5.1,17.28
N$7
  Top 0.2: U1.46 20.07,23.98 20.57,23.98 20.7,23.85 C8.1
N$8  (via drill 0.2)
  Top 0.127: U8.C2 | U8.C2 23.04,25.43 23.11,25.38 v23.62,25.38 | v22.73,27.41 22.22,26.9 22.22,26.19 U8.C2 | R13.1 25.02,25 v24.89,25.12
  Bottom 0.127: J1.4 17.65,28.93 18.67,27.92 22.22,27.92 v22.73,27.41 | v23.62,25.38 24.64,25.38 v24.89,25.12
N$9
  Top 0.127: D6.C R6.2
N$10
  Top 0.127: D5.C R17.2
N$11  (via drill 0.2)
  Top 0.127: U5.C1 3.82,16.88 3.81,16.87 3.68,16.87 2.67,15.85 v2.67,15.73 | v3.17,13.95 2.67,13.95 2.54,13.82 D1.6
  Bottom 0.127: v2.67,15.73 2.67,14.46 v3.17,13.95
N$12
  Top 0.127: U5.E1 3.9,15.18 3.17,14.46 D1.4
N$13  (via drill 0.1 layers 1-2, 0.2)
  Top 0.127: v2.03,18.27 2.03,17.84 D2.2
  Route2 0.127: U5.B2 4.32,17.25 4.32,17.76 4.06,18.01 2.29,18.01 v2.03,18.27
  other vias: 4.3,17.28
N$14  (via drill 0.2)
  Top 0.127: EXTRESET.1 23.11,26.52 v23.62,26.01 | R2.2 R13.2 v26.03,24.36 26.03,25.25 U10.3
  Bottom 0.127: v23.62,26.01 24.76,26.01 26.03,24.74 v26.03,24.36
N$15
  Top 0.127: R23.2 9.65,20.93 8.89,20.17 6.6,20.17 5.71,19.28 4.7,19.28 4.19,19.79 3.81,19.79 3.3,20.3 3.3,20.43 3.3,22.33 D4.C
N$16
  Top 0.127: C35.1 29.59,12.93 29.59,12.17 X2.1 29.21,11.79 28.57,11.79 27.94,11.15 U2.28
N$17
  Top 0.127: C34.1 29.84,9.5 29.84,9.76 30.23,10.14 X2.3 30.1,10.27 30.1,11.28 29.97,11.41 28.57,11.41 27.81,10.65 U2.27
N$19  (via drill 0.2)
  Top 0.127: R20.2 9.4,19.92 7.11,19.92 6.98,19.92 v6.73,19.66 | v6.98,14.96 6.98,13.69 6.48,13.19 3.68,13.19 2.79,12.3 2.64,12.17 D0.C
  Bottom 0.127: v6.73,19.66 6.73,16.11 6.86,15.98 6.86,15.09 v6.98,14.96
N$20
  Top 0.127: U5.B5 5.59,17.25 6.22,17.89 6.35,17.89 C53.1
N$21
  Top 0.127: U1.25 15.75,16.36 15.62,16.23 15.62,14.71 15.62,14.21 15.87,13.95 15.87,13.69 X4.3 16.39,13.31 16.38,13.31 16.42,13.28 C48.1
N$22  (via drill 0.2)
  Top 0.127: R28.1 22.17,25.12 U8.C1 22.48,25.5 USBD+.1 22.1,27.16 v22.1,27.41
  Bottom 0.127: J1.3 17.02,29.32 17.02,28.93 18.29,27.66 20.32,27.66 21.84,27.66 v22.1,27.41
N$23
  Top 0.2: U1.40 C24.1
N$24
  Top 0.127: 28.07,21.82 L7.1
  Top 0.254: U12.7 27.18,21.31 27.56,21.31 28.07,21.82
N$25
  Top 0.127: C33.1 8.35,18.61 8.38,18.65 8.51,18.52 X1.1 9.65,18.52 9.65,18.27 9.91,18.01 10.92,18.01 U1.15
N$26
  cutout Route2: 5.71,16.36 4.83,16.36 4.83,15.47 5.59,15.47 5.59,15.85 5.71,15.98
N$27
  Top 0.127: U5.B1 3.94,17.25 3.68,17.25 2.79,16.36 2.28,16.36 D2.6
N$28  (via drill 0.1 layers 1-2, 0.2 layers 1-2)
  Top 0.127: v2.92,17.25 2.67,17 2.29,17 2.27,16.98 D2.4 | U5.D2 4.34,16.47 U5.D2
  Route2 0.127: U5.D2 4.32,16.49 4.32,15.47 3.43,14.58 2.79,14.58 2.16,15.22 2.16,16.49 v2.92,17.25
  other vias: 4.3,16.48
N$29
  Top 0.127: 26.54,17.89 C21.1
  Top 0.21: C21.1 26.54,17.89 25.65,17.89 25.53,17.76
  Top 0.254: U11.1 26.54,17.3 26.54,17.5 26.54,17.89 | 25.53,17.25 25.53,17.63 25.53,17.76 24.89,17.76 24.8,17.76 U13.1 | 25.53,17.25 U13.8 | 25.53,17.25 R14.2
N$30
  Top 0.127: 18.54,29.32 D10.A 18.54,29.6
  Top 0.21: L9.2 18.54,29.6
N$31  (via drill 0.2)
  Top 0.127: R27.1 22.41,24.49 U8.A1 22.48,24.36 22.86,23.98 24.13,23.98 24.38,24.24 24.38,26.14 USBD-.1 v24.76,27.41
  Bottom 0.127: J1.2 16.38,29.19 16.38,28.93 17.91,27.41 21.46,27.41 21.97,26.9 22.86,26.9 23.37,27.41 v24.76,27.41
N$32
  Top 0.127: U4.1 7.02,10.43 6.98,10.39 5.59,10.39 5.21,10.77 C16.1
N$33
  Top 0.127: C17.1 5.08,9 5.21,9.12 5.33,9.25 6.98,9.25 7,9.23 U4.4
N$34
  Top 0.127: U1.24 15.24,16.36 15.37,16.23 15.37,14.08 15.62,13.82 15.62,13.06 15.12,12.56 X4.1 14.73,12.68 14.1,12.68 C22.1
N$35
  Top 0.127: U5.A2 4.3,17.9 3.94,18.27 3.94,18.77 D3.2
N$36
  Top 0.127: U2.25 27.43,9.63 27.56,9.63 28.07,9.12 R11.2
N$37
  Top 0.127: U5.A5 5.5,18.05 5.59,18.14 | 5.59,18.14 | 5.59,18.14 5.68,18.23 C54.1
N$38  (via drill 0.2)
  Top 0.127: v23.88,26.9 24.13,26.65 24.13,24.36 24,24.24 23.29,24.24 U8.A2
  Top 0.21: L9.1 19.43,30.46
  Top 0.254: USBV.1 19.05,30.84 19.43,30.46 22.99,30.46 23.88,29.57 v23.88,26.9
  Bottom 0.127: J1.1 15.7,29.36 15.75,29.32
  Bottom 0.254: 15.75,29.32 15.75,29.06 17.27,27.54 17.78,27.03 21.34,27.03 21.84,26.52 22.99,26.52 23.37,26.9 v23.88,26.9
N$39
  Top 0.127: U5.A1 3.56,18.01 3.17,18.01 2.41,18.77 2.35,18.84 D3.6
N$40
  Top 0.127: C32.1 8.6,16.65 8.64,16.62 X1.2 9.65,16.49 9.65,17 10.03,17.38 10.92,17.38 10.99,17.44 U1.16
N$41
  Top 0.127: U5.A4 5.1,18.29 5.21,18.39 5.21,18.77 C54.2
N$42  (via drill 0.2)
  Top 0.127: 16.76,15.98 C30.1 | 16.13,15.98 C27.1
  Top 0.2: U1.23 14.73,16.11 C31.1 14.6,15.98 v14.22,15.6 | U1.27 16.76,15.98 | C27.1 C30.1 16.76,15.98 | 16.76,15.98 17.14,15.98 17.53,15.6 v17.53,15.35 | C25.1 22.61,20.93 21.97,20.3 21.94,20.26 C26.1 21.12,20.26 v21.08,20.3 20.95,20.43 U1.39 | U1.8 10.41,21.44 10.29,21.57 C29.1 10.25,22.11 v10.16,22.2 | U1.26 16.26,15.98 16.13,15.98 | U1.55 16.24,26 16.26,26.01 C28.1 15.65,26.56 v15.62,26.52
  Top 0.254: 23.11,21.44 C25.1 23.11,21.44 | R25.1 23.11,21.44
  Bottom 0.406: v15.62,26.52 15.62,25.25 15.37,25 12.83,25 11.94,24.11 11.94,22.2 | 11.94,22.2 11.94,18.9 13.46,17.38 14.22,17.38 | 14.22,17.38 17.53,17.38 | 17.53,17.38 18.54,17.38 19.3,18.14 19.3,19.79 19.81,20.3 v21.08,20.3 | 11.94,22.2 v10.16,22.2 | 14.22,17.38 v14.22,15.6 | v17.53,15.35 17.53,17.38
N$43
  Top 0.127: 25.4,14.58 C40.1
  Top 0.254: U2.3 25.65,14.2 25.4,14.46 25.4,14.58
N$44
  Top 0.127: C19.1 26.54,19.28 26.54,19.16 26.54,19.66 26.42,19.79 R3.1
  Top 0.254: U12.5 27.42,20.31 27.43,20.3 27.81,19.92 28.19,19.92 L7.2 | U13.2 24.26,18.01 24.64,18.39 26.03,18.39 26.29,18.65 C19.1
  Top 0.406: 27.81,19.79 L7.2
  Top 0.8: 27.18,19.16 27.81,19.79
  Top 0.813: C19.1 27.18,19.16
N$45
  Top 0.127: U6.6 29.36,26.37 R33.2 29.46,26.01 U6.5
N$46  (via drill 0.2)
  Top 0.127: D3.4 2.44,19.5 3.05,18.9 3.3,18.65 v3.3,18.52 | v3.3,15.73 3.3,16.11 3.68,16.49 3.81,16.49 3.82,16.48 U5.D1
  Bottom 0.127: v3.3,18.52 3.43,18.39 3.43,15.85 v3.3,15.73
N$47
  cutout Route2: 4.57,15.47 4.57,16.23 4.7,16.36 4.7,16.62 4.57,16.74 4.57,17.76 4.44,17.76 4.44,15.47
N$48
  cutout Route2: 5.84,16.49 5.84,16.36 5.71,16.36 5.71,16.49 5.59,16.62 4.83,16.62 4.83,17.76 4.95,17.76 4.95,16.74 5.59,16.74
N$49
  Top 0.127: 26.16,14.58 C41.1
  Top 0.254: U2.2 26.16,14.08 26.16,14.58
N$50
  Top 0.127: L3.2 27.05,8.11 27.18,8.23 C47.1
N$51
  Top 0.127: C47.2 27.94,8.23 28.07,8.23 C46.1
  Top 0.2: 27.94,7.98 27.97,7.95 C6.1 27.97,7.51 27.94,7.47 27.56,7.09 L6.1
  Top 0.5: 27.94,8.23 27.94,7.98
N$52
  Top 0.127: U2.20 24.64,8.75 24.64,8.74 24.64,7.6 | 24.64,7.6 L2.1 24.64,7.6 | C45.1 C44.1 24.1,7.6 24.64,7.6
N$53
  Top 0.127: U2.21 25.15,8.74 25.15,8.23 L1.1 25.15,7.98 25.15,7.47 L2.2
N$54
  Top 0.127: U2.22 25.65,8.74 25.65,8.23 L1.2 L3.1
N$60
  Top 0.127: R31.1 27.69,24.36 28.07,24.74 28.07,25.6 U6.3
NRESET  (via drill 0.2)
  Top 0.127: U10.1 25.78,26.39 25.78,27.16 24.26,28.68 24.26,29.7 23.11,30.84 20.32,30.84 19.81,31.35 19.81,32.24 19.56,32.49 15.11,32.49 13.46,30.84 11.56,30.84 10.29,29.57 v10.29,28.81 | v6.73,28.81 JPDEBUG.3 | U1.20 13.24,16.14 v12.83,15.73
  Bottom 0.127: v10.29,28.81 v6.73,28.81 6.73,26.39 5.71,25.38 4.19,25.38 3.56,24.74 3.56,22.71 3.94,22.33 6.1,20.17 6.22,20.17 9.91,20.17 11.18,18.9 11.18,18.65 12.83,17 v12.83,15.73
NRF_RDYN  (via drill 0.2)
  Top 0.127: U1.32 19.24,16.68 19.3,16.62 19.3,15.85 19.81,15.35 20.07,15.09 v20.07,14.96 | U2.16 22.35,9.66 22.35,9.63 v21.21,9.63
  Bottom 0.127: v20.07,14.96 19.94,14.71 19.94,13.82 21.21,12.55 21.21,12.17 20.95,11.92 20.95,11.41 21.46,10.9 21.46,9.88 v21.21,9.63
NRF_REQN  (via drill 0.2)
  Top 0.127: v20.7,14.08 20.32,14.08 19.56,14.84 19.56,15.22 18.8,15.98 18.8,16.62 18.74,16.67 U1.31 | U2.12 22.35,11.66 21.84,11.66 v21.72,11.66
  Bottom 0.127: v20.7,14.08 21.72,13.06 v21.72,11.66
NRF_RESETN  (via drill 0.2)
  Top 0.127: U2.19 24.13,8.61 24.13,8.49 24,8.36 22.35,8.36 v21.72,9 | U1.33 19.94,16.23 20.7,15.47 v20.7,14.71
  Bottom 0.127: v20.7,14.71 20.19,14.2 20.19,13.95 21.46,12.68 21.46,12.04 21.21,11.79 21.21,11.54 21.72,11.03 v21.72,9
PWR_HIGH  (via drill 0.2)
  Top 0.127: U1.54 16.74,26.37 v16.89,26.52 | U12.1 24.9,21.81 24.89,21.82 24.89,22.08 24.38,22.58 23.75,22.58 23.24,23.09 v23.11,23.09
  Bottom 0.127: v16.89,26.52 17.14,26.27 20.7,26.27 21.08,25.89 21.08,23.47 21.72,22.84 22.22,22.84 22.86,22.84 v23.11,23.09
PWR_MODE
  Top 0.127: U12.3 24.76,20.81 24.51,21.06 24.51,21.95 24.13,22.33 23.62,22.33 23.37,22.58 21.59,22.58 21.11,23.06 20.55,23.06 20.45,22.97 U1.44
PWR_SEL  (via drill 0.2)
  Top 0.127: U13.3 23.75,17.76 R4.1 22.99,17.89 v22.99,18.65 | U1.43 20.68,22.44 v20.83,22.58
  Bottom 0.127: v20.83,22.58 22.48,22.58 22.99,22.08 v22.99,18.65
SPI0_CLK
  Top 0.127: U16.C1 U18.3
SPI0_CSN  (via drill 0.2)
  Top 0.127: U16.A2 v5.33,20.04 5.71,20.04 6.35,20.68 6.35,21.19 6.73,21.57 7.1,21.57 U18.4 | v4.06,20.3 R7.2
  Bottom 0.127: v5.33,20.04 5.08,20.3 v4.06,20.3
SPI0_MISO
  Top 0.127: U16.B2 4.7,21.45 4.57,21.31 4.57,19.92 4.95,19.54 5.59,19.54 6.6,20.55 6.6,21.06 6.73,21.19 6.98,21.19 7.11,21.14 U18.5
SPI0_MOSI
  Top 0.127: U16.D1 6.36,22.45 6.48,22.33 7.1,22.33 U18.2
SPI0_V+
  Top 0.127: C55.1 4.61,21.86 4.7,21.95 5.21,21.95 U16.C2 U16.B1 U16.A1 5.85,20.93 | U17.A2 4.12,23.65 C36.1 | 3.68,21.95 3.68,23.47 3.81,23.6 4.06,23.6 C36.1 | 3.68,21.95 | 3.68,21.95 3.78,21.86 C55.1 | U18.12 7.87,23.22 7.75,23.35 6.73,23.35 6.6,23.35 6.48,23.22 6.48,23.09 | 6.48,23.09 4.57,23.09 4.32,23.35 C36.1 | U18.1 6.77,22.8 6.64,22.8 6.48,22.97 6.48,23.09 | R7.1 4.19,21.44 4.19,21.7 C55.1
SWCLK  (via drill 0.2)
  Top 0.127: U1.49 19.3,25.64 19.3,25.63 v19.94,25.63 | v13.59,27.28 13.33,27.03 12.32,27.03 11.94,27.41 8.64,27.41 8.51,27.54 8.46,27.54 JPDEBUG.4
  Bottom 0.127: v19.94,25.63 19.56,26.01 16.51,26.01 16.38,26.14 16.38,26.78 15.87,27.28 15.37,27.28 15.24,27.16 13.72,27.16 v13.59,27.28
SWDIO  (via drill 0.2)
  Top 0.127: U1.50 18.74,26.09 18.92,26.27 20.19,26.27 20.57,25.89 20.57,25.76 v20.57,25.63 | v12.95,27.54 12.83,27.66 10.16,27.66 9.27,28.55 JPDEBUG.2
  Bottom 0.127: v20.57,25.63 20.45,25.51 20.07,25.12 19.81,25.12 19.18,25.76 16.38,25.76 16.13,26.01 16.13,26.65 15.75,27.03 15.49,27.03 15.24,26.78 13.46,26.78 12.95,27.28 12.95,27.41 v12.95,27.54
US0_CLK
  Top 0.127: U1.60 13.74,26.11 13.59,26.27 11.94,26.27 11.56,26.65 10.92,26.65 9.4,25.12 9.4,22.33 9.02,21.95 U18.9
US0_MISO  (via drill 0.2)
  Top 0.127: v9.78,26.27 10.41,26.9 11.68,26.9 12.06,26.52 13.84,26.52 14.22,26.14 14.22,25.66 U1.59 | U18.7 8.62,20.79 v8.51,20.68
  Bottom 0.127: v8.51,20.68 8.38,20.68 8.13,20.93 8.13,24.62 v9.78,26.27
US0_MOSI
  Top 0.127: U18.10 8.64,22.33 8.64,22.34 U18.10 8.64,22.33 9.02,22.33 9.14,22.46 9.14,26.27 10.03,27.16 11.81,27.16 12.19,26.78 14.1,26.78 14.75,26.12 14.75,25.65 U1.58
US0_PWR  (via drill 0.2)
  Top 0.127: U1.4 10.25,23.44 v10.16,23.47 | U17.B1 5.03,24.92 5.21,25.12 5.71,25.12 6.73,24.11 v8.64,24.11
  Bottom 0.127: v10.16,23.47 9.52,24.11 v8.64,24.11
US1_CLK  (via drill 0.2)
  Top 0.127: U1.30 18.24,16.66 18.29,16.62 18.29,16.11 18.67,15.73 18.67,15.35 19.43,14.58 v19.43,14.08 | U2.11 22.22,12.16 21.98,12.16 21.84,12.3 v20.7,12.3 | U3.4 18.03,7.22 18.16,7.09 19.68,7.09 v20.7,8.11
  Bottom 0.127: v20.7,8.11 20.7,10.01 21.21,10.52 21.21,10.77 20.7,11.28 v20.7,12.3 20.7,12.68 19.43,13.95 v19.43,14.08
US1_MISO  (via drill 0.2)
  Top 0.127: U1.29 17.78,16.23 18.41,15.6 18.41,14.96 v18.92,14.46 | U2.14 22.35,10.66 22.35,10.65 v20.7,10.65 | U3.7 v20.19,8.74
  Bottom 0.127: v20.19,8.74 20.45,9 20.45,10.65 | 20.45,10.65 v20.7,10.64 v20.7,10.65 20.45,10.65 | 20.45,10.65 20.45,11.92 20.19,12.17 20.19,12.68 18.92,13.95 v18.92,14.46
US1_MOSI  (via drill 0.2)
  Top 0.127: U1.28 17.27,16.36 18.16,15.47 18.16,14.08 v18.54,13.69 | U2.13 22.35,11.16 22.35,11.15 v19.94,11.15 | U3.6 18.8,8.23 v19.68,8.23
  Bottom 0.127: v19.68,8.23 19.68,8.87 19.94,9.12 v19.94,11.15 19.94,12.3 18.8,13.44 v18.54,13.69
USB_DM
  Top 0.127: U1.47 20.07,24.49 R27.2
USB_DP
  Top 0.127: U1.48 20.51,24.94 20.57,25 20.7,25.12 R28.2
USB_VBUS  (via drill 0.2)
  Top 0.127: v22.35,23.35 22.22,23.35 20.32,23.35 U1.45 | 15.49,27.67 v15.11,27.66 | 29.97,21.82 29.72,21.82 29.59,21.7 R12.1 | 31.62,19.28 31.75,19.41 31.62,19.41 31.62,19.28 | 31.5,19.28 C5.1 31.5,19.28
  Top 0.152: C5.1 31.62,19.28
  Top 0.254: 31.62,19.28 U7.1 | U7.2 31.11,18.9 31.5,19.28 32.13,19.28 32.26,19.41 32.26,20.93 31.62,21.57 | 30.23,21.57 31.62,21.57 | 31.62,21.57 31.62,22.97 31.24,23.35 31.24,24.11 30.99,24.36 30.61,24.36 | v22.35,23.35 22.61,23.6 23.49,23.6 23.88,23.22 27.94,23.22 28.19,23.47 28.19,24.36 28.83,25 30.35,25 30.61,24.74 30.61,24.36 | U14.5 29.97,21.82 | 29.97,21.82 30.23,21.57 | 30.61,24.36 30.61,24.37 U14.1 | 30.23,21.57 29.97,21.82
  Top 0.3: 17.91,27.66 17.74,27.37 U1.52
  Top 0.305: C15.1 17.91,27.66
  Top 0.406: 31.62,19.41 C5.1 | v15.11,27.66 C15.1 | D10.C 15.49,27.67
  Bottom 0.254: v22.35,23.35 21.72,23.35 21.46,23.6 21.46,26.01 20.83,26.65 17.53,26.65 17.02,27.16 16.51,27.16 16,27.66 15.24,27.66 v15.11,27.66
VCC  (via drill 0.2, 0.2 pad 0.2)
  Top 0.127: 15.49,10.08 v15.49,10.01 | U9.3 10.29,14.58 | U3.1 U3.1 arc147 16.51,7.6 | 24.89,15.98 C3.1 | U2.24 26.67,8.74 | U2.26 27.92,10.16 v28.19,9.88 | U2.9 22.48,13.19 | 26.92,14.58 C42.1 | D4.A 2.41,21.44 v2.29,20.93 | U17.A1 5.53,23.65 C11.1 5.59,23.6 v6.22,23.6 8.51,23.6 8.64,23.47 8.64,22.76 U18.11 | v3.56,11.66 3.43,11.66 D0.A | v24.51,23.73 R2.1 | R15.1 v28.57,14.96 | U1.1 10.47,24.94 v10.16,25.25
  Top 0.2: v14.86,7.34 14.89,7.38 C23.1 15.78,7.38 16,7.6 16.13,7.6 16.51,7.6 | v15.49,10.01 C1.1 15.91,9.34 16,9.25 U3.14 | 9.65,14.58 R5.2 | C3.1 25.4,15.98 v25.53,16.11 | v23.62,14.58 23.59,14.62 C43.1 22.48,13.19 | 27.69,13.69 C39.1 | D5.A D6.A 17.91,31.98 v19.35,31.98
  Top 0.21: 8.64,14.58 C10.1
  Top 0.254: 10.29,14.58 9.65,14.58 | U9.2 U9.3 | U13.7 24.76,16.5 24.89,16.36 24.89,15.98 | R14.1 v25.53,16.11 | U2.29 27.81,11.66 v28.19,12.04 28.07,12.17 28.07,13.69 | 26.67,8.74 27.18,8.74 v27.43,9 | 26.92,14.58 v27.43,14.58 | U2.1 26.67,14.2 26.92,14.46 26.92,14.58 | 26.92,14.58 C42.1 | v27.56,13.69 27.69,13.69 | R5.2 8.64,14.58 v8,14.58
  Top 0.305: v22.1,21.82 R25.2
  Top 0.61: JPDEBUG.1 8.18,29.32 8.13,29.32 v7.37,29.32
  Bottom 0.305: v28.19,12.04 v28.19,9.88 28.19,9.76 v27.43,9 | v23.62,14.58 24,14.2 27.05,14.2 v27.43,14.58
  Bottom 0.406: J2.2 7.62,4.8 7.37,5.06 v7.37,6.71
  pour Route15: 12.89,32.37 arc117 5.06,6.48 28.94,6.48 arc117 21.11,32.37
VUNREG  (via drill 0.2)
  Top 0.127: 26.8,22.71 C18.1 | U11.4 28.94,15.84 29.08,15.98 29.08,16.66 29.08,17 28.94,17.14 U11.6 | 26.8,25.23 U10.4 26.77,25.25 26.92,25.25 26.96,25.29 27.18,25.25 27.34,25.41 C9.1 v27.56,24.87 | U5.C5 5.58,16.88 5.59,16.87 5.71,16.87 5.84,16.74 6.22,16.74 C50.1
  Top 0.2: C50.1 6.35,17.12 v6.22,17.25
  Top 0.21: v28.7,17.89 28.32,17.89 | 28.32,17.89 C20.1 28.32,17.89 | 28.32,17.14 28.32,17.89
  Top 0.24: 28.32,17.14 U11.6
  Top 0.254: 26.8,21.82 26.92,21.82 U12.8 | U14.6 30.63,22.18 30.73,22.08 v31.11,22.08 | v28.57,22.71 28.7,22.58 29.3,22.58 U14.4
  Top 0.3: C18.1 26.8,22.71 26.8,22.58 26.8,21.82
  Top 0.406: v28.57,22.71 C18.1 | v6.35,14.96 v6.35,13.69 | v13.72,8.74 13.72,11.03 v13.84,11.15
  Bottom 0.127: 26.8,22.73 26.8,22.71
  Bottom 0.2: J2.5 11.3,4.8 11.18,4.93 11.18,6.2 11.68,6.71 13.59,8.61 v13.72,8.74
  Bottom 0.254: v6.22,17.25 6.22,16.11 6.48,15.85 6.48,15.09 v6.35,14.96 | v31.11,22.08 31.11,22.46 30.86,22.71 v28.57,22.71
  Bottom 0.406: v28.57,22.71 26.8,22.71 26.8,20.3 28.7,18.39 v28.7,17.89 24.76,17.89 23.37,16.49 23.11,16.23 22.99,16.11 22.61,15.73 22.48,15.6 19.18,15.6 17.91,14.33 17.91,11.54 17.53,11.15 v13.84,11.15 | v27.56,24.87 26.8,24.11 26.8,22.73 | v6.35,13.69 7.62,12.42 11.3,12.42 12.57,11.15 12.57,9.88 v13.72,8.74
(copper drawn outside any net)
  shapes: Top circle x2

## Text on the board
tDocu: PTH | PTH | No Floating Metal in this area.
bDocu: No Floating Metal in this area.
tSilk: - | + | c | 2013 Firefly Design LLC | Ice Blue 1.4
bSilk: - | + | 2013 Firefly Design LLC | c | Ice Blue 1.4
_tDocu: R6 | D6 | USBV | R17 | D5 | L9 | L4 | BAT1 | D10 | C15 | USBD+ | USBID | USBD- | C28 | U10 | U6 | R33 | U1 | R28 | U8 | R2 | C9 | R31 | C36 | U17 | C11 | R27 | R32 | U14 | U18 | C8 | C18 | D4 | C55 | R25 | U12 | R7 | U16 | C29 | R23 | C24 | C25 | R10 | L7 | D3 | R20 | C26 | R3 | C4 | C5 | C52 | C54 | C33 | X1 | C19 | U5 | C53 | R4 | U13 | C21 | C20 | U7 | D2 | C50 | C32 | R14 | U11 | C31 | C27 | C30 | C3 | D1 | C10 | C43 | C40 | C41 | C42 | R15 | R8 | R5 | U9 | C39 | C35 | C2 | C22 | X4 | C48 | U2 | D0 | X2 | C16 | C13 | C14 | U4 | C12 | C34 | C17 | C1 | R11 | R9 | R1 | U3 | C44 | L2 | L1 | L3 | C47 | C6 | C46 | C23 | C45 | L6 | C7 | A1
_bDocu: J1 | C51 | J2